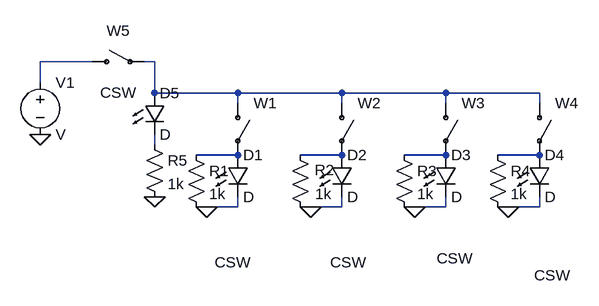
[diagram p0: schematic LED and switches.asc]
LED and switches.asc, the LTspice schematic file:
Version 4
SHEET 1 880 680
WIRE 0 64 -80 64
WIRE 96 64 80 64
WIRE -80 96 -80 64
WIRE 96 112 96 64
WIRE 224 112 96 112
WIRE 384 112 224 112
WIRE 544 112 384 112
WIRE 688 112 544 112
WIRE 224 128 224 112
WIRE 384 128 384 112
WIRE 544 128 544 112
WIRE 688 128 688 112
WIRE 96 192 96 176
WIRE 224 208 160 208
WIRE 384 208 320 208
WIRE 544 208 480 208
WIRE 688 208 624 208
WIRE 176 288 160 288
WIRE 224 288 224 272
WIRE 224 288 176 288
WIRE 336 288 320 288
WIRE 384 288 384 272
WIRE 384 288 336 288
WIRE 496 288 480 288
WIRE 544 288 544 272
WIRE 544 288 496 288
WIRE 640 288 624 288
WIRE 688 288 688 272
WIRE 688 288 640 288
FLAG -80 176 0
FLAG 96 272 0
FLAG 336 288 0
FLAG 496 288 0
FLAG 640 288 0
FLAG 176 288 0
SYMBOL voltage -80 80 R0
SYMATTR InstName V1
SYMBOL csw 224 128 R0
WINDOW 3 -36 245 Left 2
SYMATTR InstName W1
SYMBOL csw 384 128 R0
WINDOW 3 -18 245 Left 2
SYMATTR InstName W2
SYMBOL csw 544 128 R0
WINDOW 3 -14 239 Left 2
SYMATTR InstName W3
SYMBOL csw 688 128 R0
WINDOW 3 -8 265 Left 2
SYMATTR InstName W4
SYMBOL csw 0 64 R270
WINDOW 0 32 40 VTop 2
WINDOW 3 -32 40 VBottom 2
SYMATTR InstName W5
SYMBOL LED 208 208 R0
SYMATTR InstName D1
SYMBOL LED 368 208 R0
SYMATTR InstName D2
SYMBOL LED 528 208 R0
SYMATTR InstName D3
SYMBOL LED 672 208 R0
SYMATTR InstName D4
SYMBOL LED 80 112 R0
SYMATTR InstName D5
SYMBOL res 144 192 R0
SYMATTR InstName R1
SYMATTR Value 1k
SYMBOL res 304 192 R0
WINDOW 0 38 39 Left 2
WINDOW 3 39 76 Left 2
SYMATTR InstName R2
SYMATTR Value 1k
SYMBOL res 464 192 R0
SYMATTR InstName R3
SYMATTR Value 1k
SYMBOL res 608 192 R0
SYMATTR InstName R4
SYMATTR Value 1k
SYMBOL res 80 176 R0
SYMATTR InstName R5
SYMATTR Value 1k

The netlist it stands for:
* LED and switches.asc
V1 N001 0 V
W1 N002 N004 CSW
W2 N002 N005 CSW
W3 N002 N006 CSW
W4 N002 N007 CSW
W5 N001 N002 CSW
D1 N004 0 D
D2 N005 0 D
D3 N006 0 D
D4 N007 0 D
D5 N002 N003 D
R1 N004 0 1k
R2 N005 0 1k
R3 N006 0 1k
R4 N007 0 1k
R5 N003 0 1k
.model D D
.lib standard.dio
.backanno
.end